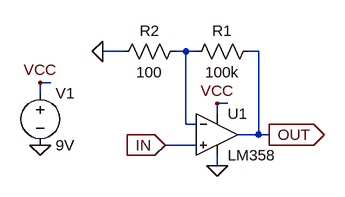
[diagram p0: schematic Single_Supply_NonInV_Amp_sch.asc]
Single_Supply_NonInV_Amp_sch.asc, the LTspice schematic file:
Version 4
SHEET 1 880 680
WIRE 160 48 128 48
WIRE 256 48 240 48
WIRE 272 48 256 48
WIRE 368 48 352 48
WIRE 48 96 32 96
WIRE 32 112 32 96
WIRE 320 128 304 128
WIRE 304 144 304 128
WIRE 256 160 256 48
WIRE 272 160 256 160
WIRE 368 176 368 48
WIRE 368 176 336 176
WIRE 384 176 368 176
WIRE 272 192 224 192
WIRE 304 224 304 208
FLAG 32 192 0
FLAG 32 96 VCC
FLAG 304 224 0
FLAG 304 128 VCC
FLAG 128 48 0
FLAG 384 176 OUT
IOPIN 384 176 Out
FLAG 224 192 IN
IOPIN 224 192 In
SYMBOL voltage 32 96 R0
WINDOW 123 0 0 Left 2
WINDOW 39 0 0 Left 2
SYMATTR InstName V1
SYMATTR Value 9V
SYMBOL res 368 32 R90
WINDOW 0 0 56 VBottom 2
WINDOW 3 32 56 VTop 2
SYMATTR InstName R1
SYMATTR Value 100k
SYMBOL res 256 32 R90
WINDOW 0 0 56 VBottom 2
WINDOW 3 32 56 VTop 2
SYMATTR InstName R2
SYMATTR Value 100
SYMBOL Opamps\\opamp2 304 112 R0
SYMATTR InstName U1
SYMATTR Value LM358

The netlist it stands for:
* Single_Supply_NonInV_Amp_sch.asc
V1 VCC 0 9V
R1 OUT N001 100k
R2 N001 0 100
XU1 IN N001 VCC 0 OUT LM358  ; pins In+ In- V+ V- OUT
.backanno
.end